# Altium schematic sheet PWM_Controller_SG3525.SchDoc
size A1; SPICEModelCacheYQEDCYZF: <root> / <DocumentId>YQEDCYZF</DocumentId> / <CacheFrame Number="0"> / <Model Name="7850_744775147_47u" Kind="CKT"> / <Text>******* / .subckt 7850_744775147_47u 1 2 / Rp 1 2 40000 / Cp 1 2 4p / Rs 1 N3 0.1343 / L1 N3 2 47u / .ends 7850_744775147_47u</Text> / </Model> / </CacheFrame> / </root>
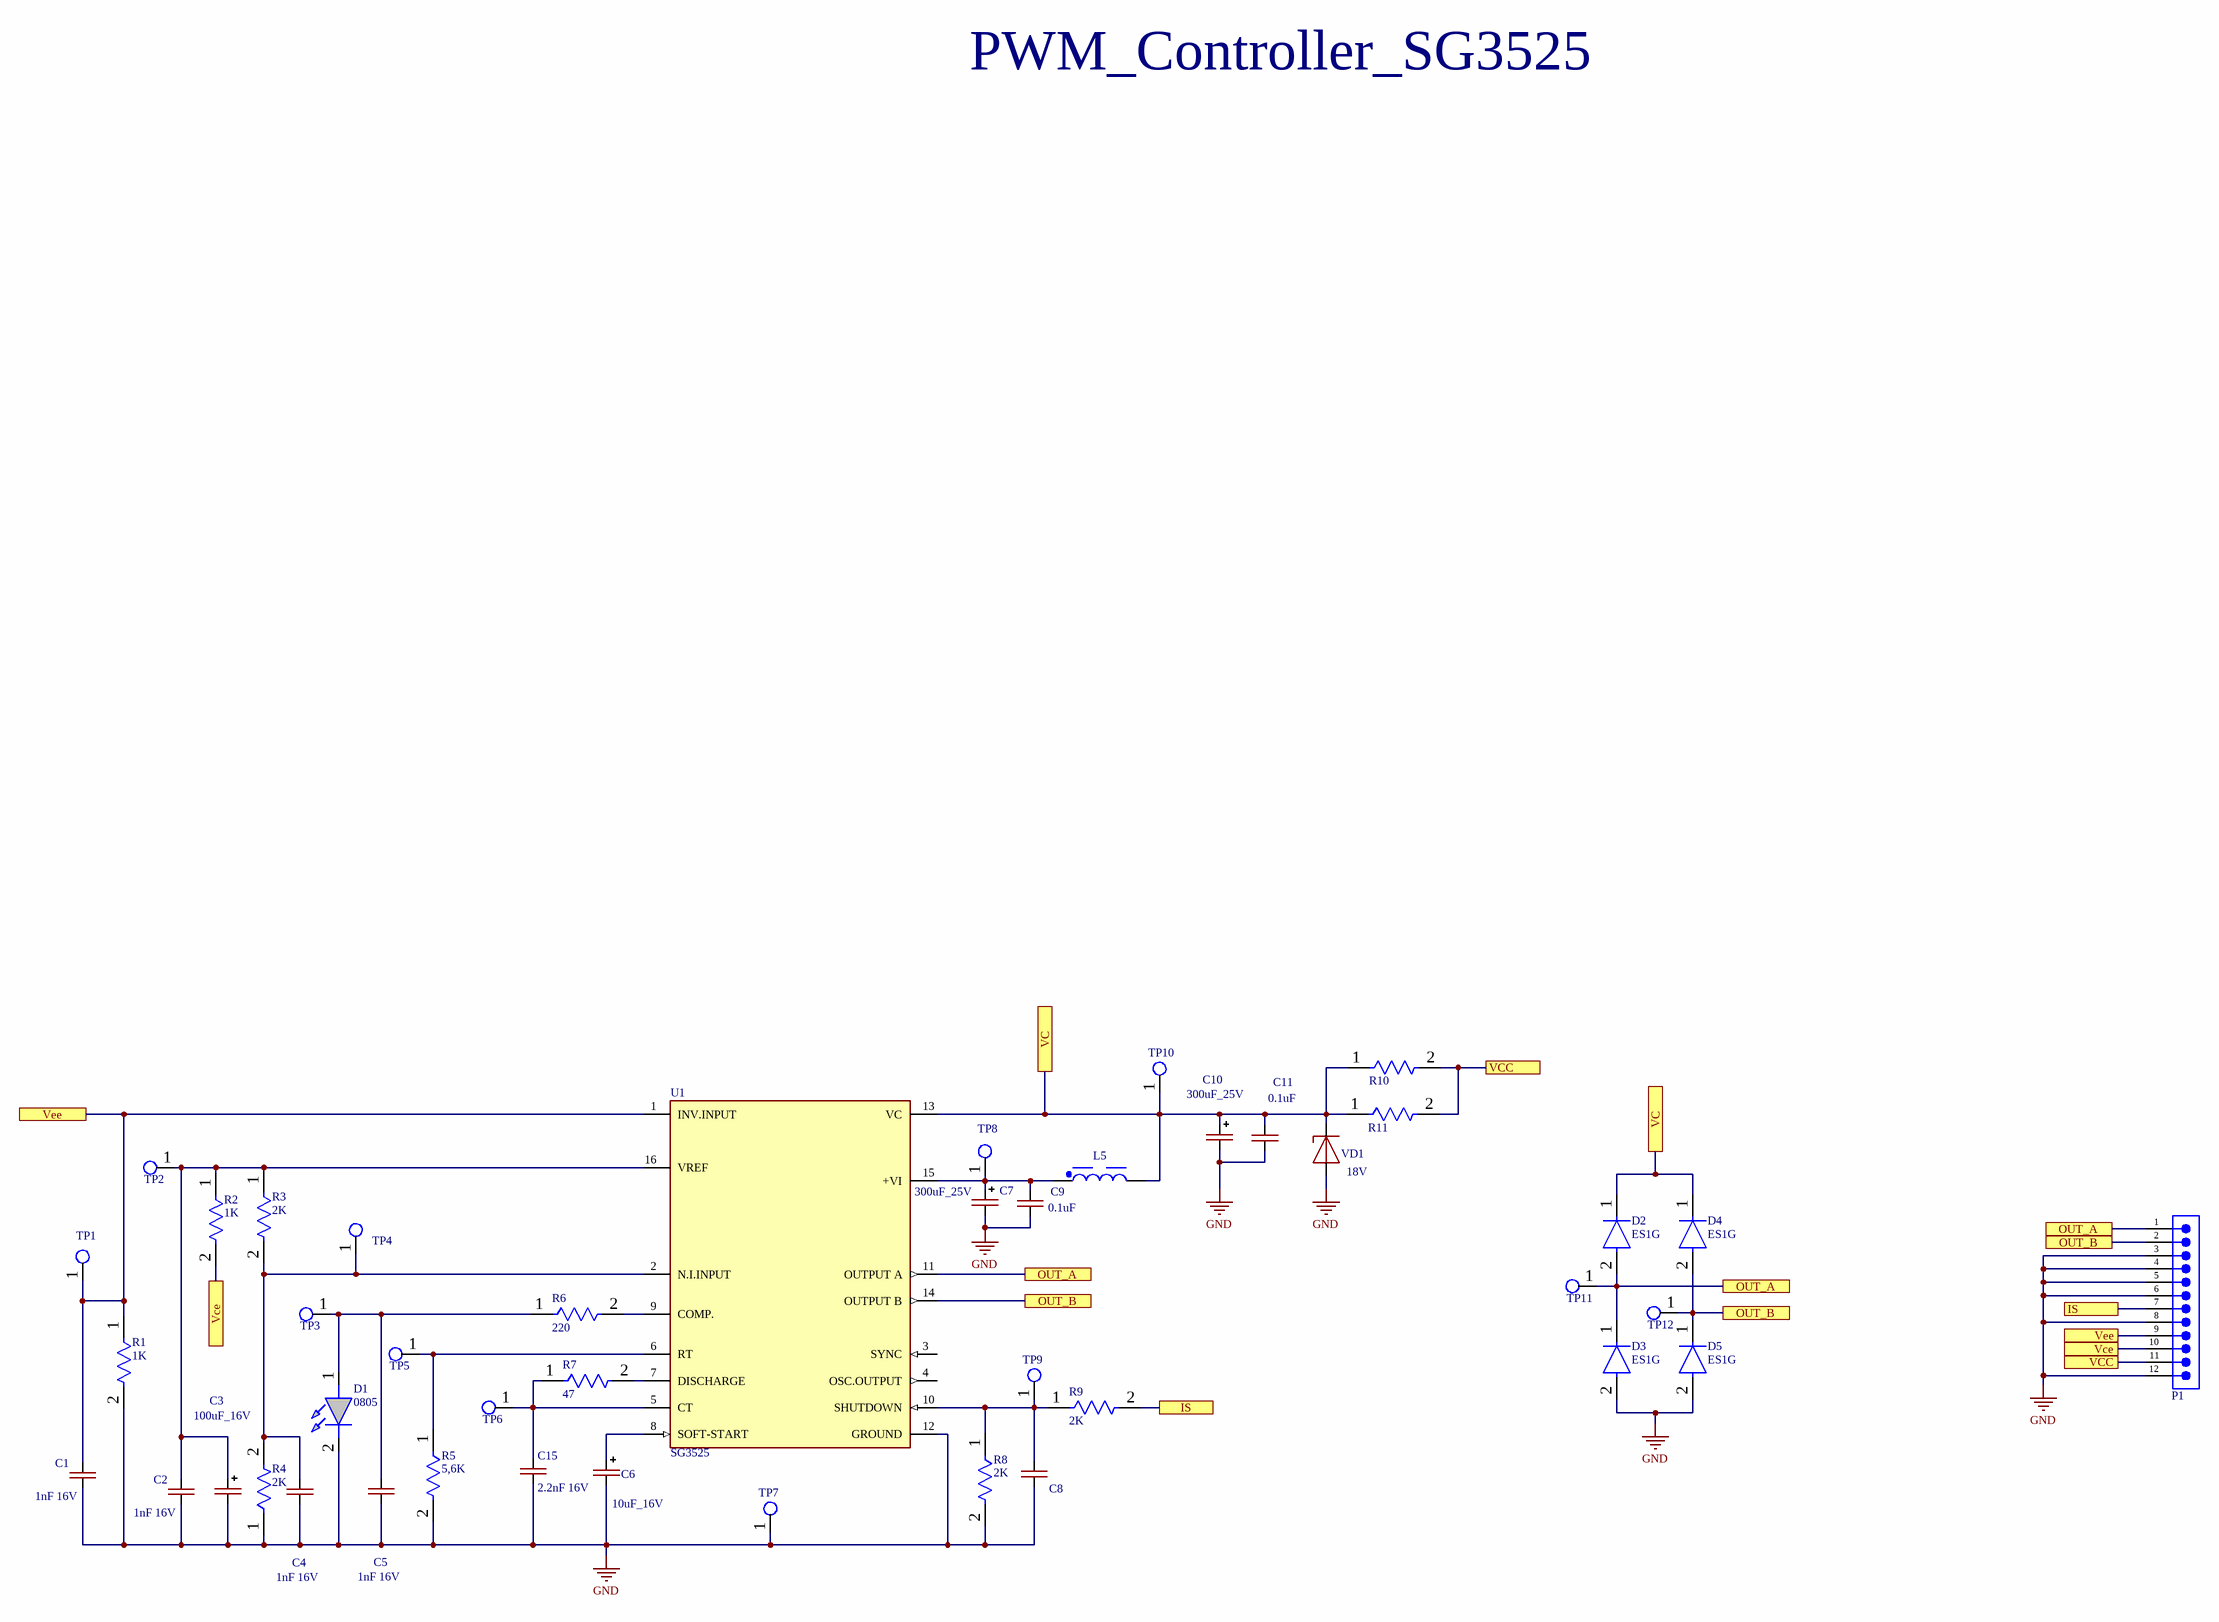
[diagram p0: PWM_Controller_SG3525.SchDoc]

## Parts
C1  1nF 16V  [CAP-0805]
C2  1nF 16V  [CAP-0805]
C3  100uF_16V  [CAP-TAN-D]
C4  1nF 16V  [CAP-0805]
C5  1nF 16V  [CAP-0805]
C6  10uF_16V  [CAP-TAN-D]
C7  300uF_25V  [CAP_SMD_Size_G]
C8  CAP-NON-POLAR  [CAP-0805]  (value not drawn)
C9  0.1uF  [CAP-0805]
C10  300uF_25V  [CAP_SMD_Size_G]
C11  0.1uF  [CAP-0805]
C15  2.2nF 16V  [CAP-0805]
D1  0805  [LED_RED]
D2  ES1G  [FP-403AE-MFG]
D3  ES1G  [FP-403AE-MFG]
D4  ES1G  [FP-403AE-MFG]
D5  ES1G  [FP-403AE-MFG]
L5  47µH, 1.17A  [WE-PD2_7850]  (value not drawn)
P1  61301211021  [61301211021]  (value not drawn)
R1  1K  [RES-0805]
R2  1K  [RES-0805]
R3  2K  [RES-0805]
R4  2K  [RES-0805]
R5  5,6K  [RES-0805]
R6  220  [RES-0805]
R7  47  [RES-0805]
R8  2K  [RES-0805]
R9  2K  [RES-0805]
R10  RES_1210  [RES_SMD_1210_IPC_A]  (value not drawn)
R11  RES_1210  [RES_SMD_1210_IPC_A]  (value not drawn)
TP1  (no value)  [Test_Point]
TP2  (no value)  [Test_Point]
TP3  (no value)  [Test_Point]
TP4  (no value)  [Test_Point]
TP5  (no value)  [Test_Point]
TP6  (no value)  [Test_Point]
TP7  (no value)  [Test_Point]
TP8  (no value)  [Test_Point]
TP9  (no value)  [Test_Point]
TP10  (no value)  [Test_Point]
TP11  (no value)  [Test_Point]
TP12  (no value)  [Test_Point]
U1  SG3525  [SOIC-16-L]
VD1  18V  [DO-017AA]

## Ports
IS, OUT_A, OUT_B, VC, VCC, Vce, Vee

## Nets
GND: C1.1 C2.1 C3.2(-) C4.1 C5.1 C6.2(-) C7.2(-) C8.1 C9.1 C10.2(-) C11.1 C15.1 D1.2(K) D3.2(A) D5.2(A) P1.3 P1.4 P1.5 P1.6 P1.8 P1.12 R1.2 R4.1 R5.2 R8.2 TP7.1(G9) U1.12(GROUND) VD1.2(A)
IS: P1.7 R9.2 ; port IS
OUT_A: D2.2(A) D3.1(C) P1.1 TP11.1(G9) U1.11(OUTPUT_A) ; port OUT_A
OUT_B: D4.2(A) D5.1(C) P1.2 TP12.1(G9) U1.14(OUTPUT_B) ; port OUT_B
VC: C10.1(+) C11.2 D2.1(C) D4.1(C) L5.2 R10.1 R11.1 TP10.1(G9) U1.13(VC) VD1.1(C) ; port VC
VCC: P1.11 R10.2 R11.2 ; port VCC
Vce: P1.10 R2.2 ; port Vce
Vee: C1.2 P1.9 R1.1 TP1.1(G9) U1.1(INV.INPUT) ; port Vee
NetC2_2: C2.2 C3.1(+) R2.1 R3.1 TP2.1(G9) U1.16(VREF)
NetC4_2: C4.2 R3.2 R4.2 TP4.1(G9) U1.2(N.I.INPUT)
NetC5_2: C5.2 D1.1(A) R6.1 TP3.1(G9)
NetC6_1: C6.1(+) U1.8(SOFT-START)
NetC7_1: C7.1(+) C9.2 L5.1 TP8.1(G9) U1.15(+VI)
NetC8_2: C8.2 R8.1 R9.1 TP9.1(G9) U1.10(SHUTDOWN)
NetC15_2: C15.2 R7.1 TP6.1(G9) U1.5(CT)
NetR5_1: R5.1 TP5.1(G9) U1.6(RT)
NetR6_2: R6.2 U1.9(COMP.)
NetR7_2: R7.2 U1.7(DISCHARGE)

Not connected (* = marked no-connect by the designer): U1 3(SYNC) 4(OSC.OUTPUT)

## Notes on the sheet
- PWM_Controller_SG3525

## Library data of the parts
C1 C2 C4 C5 C9 C11 C15 = CAP-NON-POLAR
C3 C6 = CAP-POLAR
C7 C10 = CAP_POL_SMD
D1 = LED: WURTH ELEKTRONIK - 151031YS06000 - LED, Yellow, Through Hole, T-1 (3mm), 30 mA, 2 V, 590 nm; Geometry.Height: 5.5mm; Manufacturer_Name: Wurth Elektronik; Manufacturer_Part_Number: 151031YS06000; Mouser Part Number: 710-151031YS06000; Mouser Price/Stock: https://www.mouser.co.uk/ProductDetail/Wurth-Elektronik/151031YS06000?qs=LlUlMxKIyB3xSYYW%252BcuBiQ%3D%3D; Arrow Part Number: *; Arrow Price/Stock: *; Mouser Testing Part Number: *; Mouser Testing Price/Stock: *; Datasheet Link: https://katalog.we-online.de/led/datasheet/151031YS06000.pdf
D2-D5 = ES1G: Ultrafast
L5 = 744775147: WE-PD2 SMT Power Inductor, size 7850, 47µH, 1.17A, 0.18Ω; Manufacturer: Wurth Elektronik; Case/Size Code: 7850; DC Resistance: 0.134Ω; Saturation Current: 1.24A; Self Resonant Frequency: 12MHz; Manufacturer Part Number: 744775147; Category: Unshielded Power Inductors; Match Code: WE-PD2; ComponentLink1Description: Website Link; ComponentLink1URL: https://www.we-online.com/redexpert/article/744775147?ad; ComponentLink2Description: Datasheet Link; ComponentLink2URL: https://www.we-online.com/redexpert/spec/744775147?ad; Mount: Surface Mount; Operating Temperature Max: 125°C; Operating Temperature Min: -40°C; Packaging: Tape and Reel; Length: 7.8mm; Width: 7mm; Height: 4.95mm; DC Resistance Max: 0.18Ω; Inductance: 47µH; Rated Current: 1.17A
P1 = 61301211021: WR-PHD Pin Header, THT, Angled, pitch 2.54mm, 1 Row, 12P; Manufacturer: Wurth Elektronik; Contact Resistance: 20mΩ; Rated Current: 3A; Working Voltage: 250V; Withstanding Voltage: 500V; ComponentLink1Description: Website Link; ComponentLink1URL: https://www.we-online.com/redexpert/article/61301211021?ad; ComponentLink2Description: Datasheet Link; ComponentLink2URL: https://www.we-online.com/redexpert/spec/61301211021?ad; Manufacturer Part Number: 61301211021; Category: Board-to-Board Connectors; Match Code: WR-PHD; Mount: Through Hole; Operating Temperature Max: 105°C; Operating Temperature Min: -40°C; Packaging: Bag; Gender: Pin Header; Number of Pins: 12; Number of Rows: 1; Orientation: Angled; Pitch: 2.54mm
R1-R9 = RES-CONST
TP1-TP12 = TP_PCB?: Test_Point
VD1 = ZENER